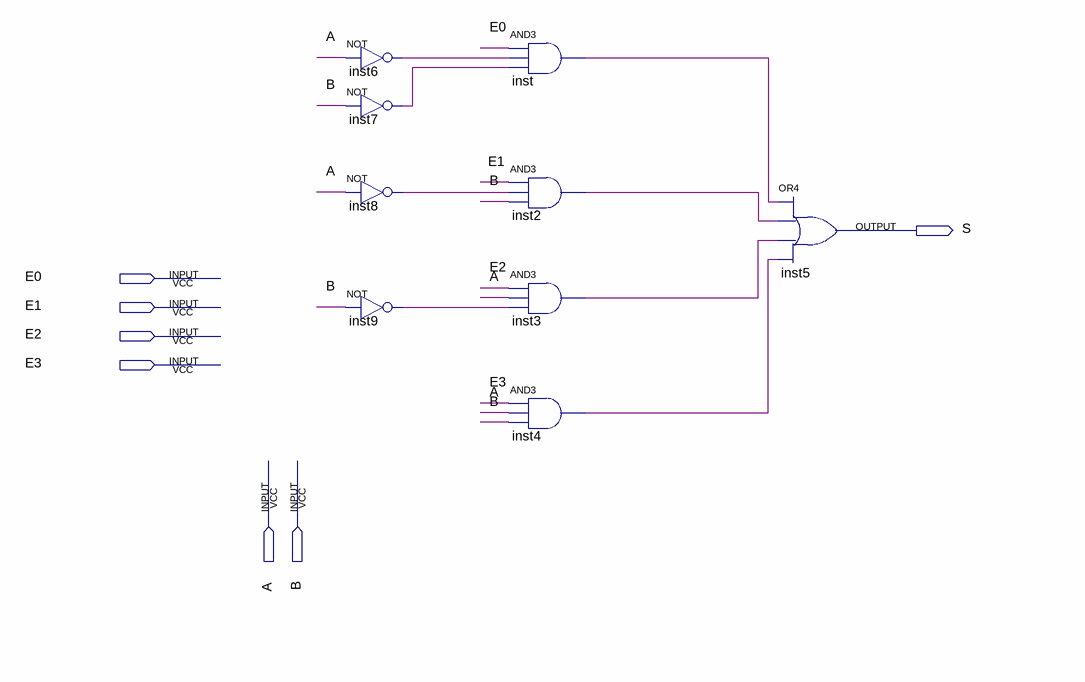
[diagram p0: schematic sheet]
// Quartus schematic multiplex4bits.bdf as structural Verilog: 9 symbols, 7 pins
module multiplex4bits (
  input  E0,
  input  E1,
  input  E2,
  input  E3,
  input  A,
  input  B,
  output S
);

  wire inst2_out, inst3_out, inst4_out, inst6_out, inst7_out, inst8_out, inst9_out, inst_out;

  not inst6 (inst6_out, A);
  not inst7 (inst7_out, B);
  not inst8 (inst8_out, A);
  not inst9 (inst9_out, B);
  and inst (inst_out, E0, inst6_out, inst7_out);
  and inst2 (inst2_out, E1, inst8_out, B);
  and inst3 (inst3_out, E2, A, inst9_out);
  and inst4 (inst4_out, E3, A, B);
  or inst5 (S, inst_out, inst2_out, inst3_out, inst4_out);
endmodule
